# Altium schematic sheet [12] - UARTS.SchDoc
size A3; DocumentNumber: 12; SheetNumber: 12; SheetTotal: 18
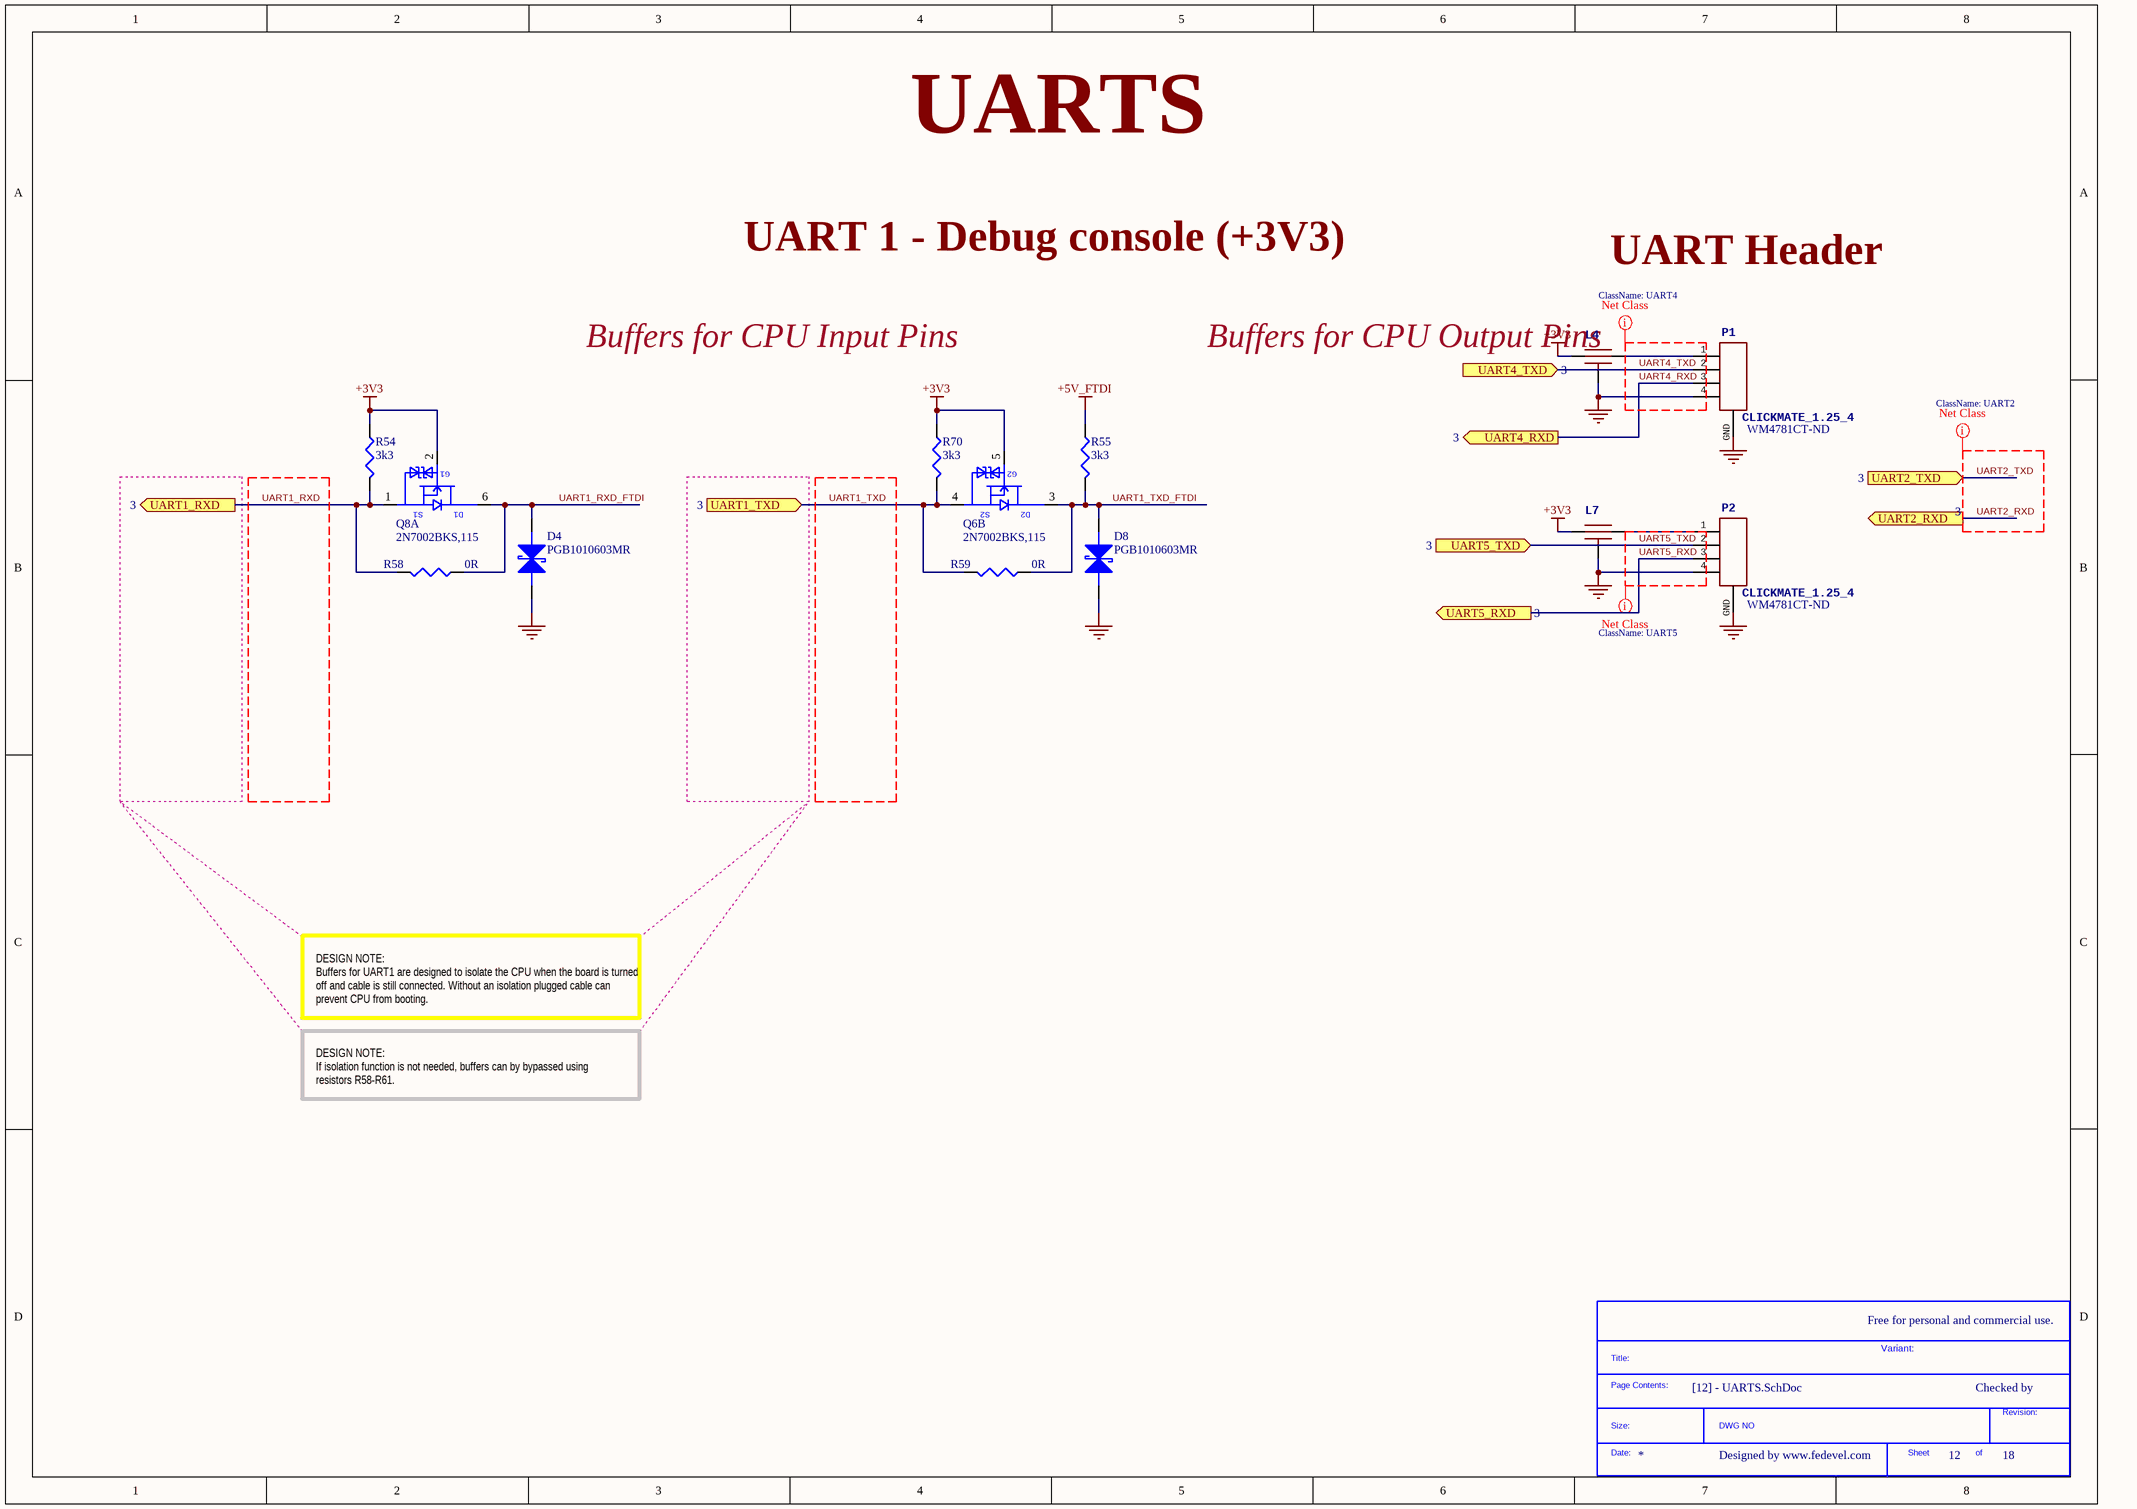
[diagram p0: [12] - UARTS.SchDoc]

## Parts
*  SDTitleBlock  (value not drawn)  (graphical)
D4  PGB1010603MR  [C0603]
D8  PGB1010603MR  [C0603]
L4  Kyocera KNH16C104DA5TS EMI filter  [KYOCERA-KNH16-DA]  (value not drawn)
L7  Kyocera KNH16C104DA5TS EMI filter  [KYOCERA-KNH16-DA]  (value not drawn)
P1  CLICKMATE_1.25_4  Supplier Part Number 1: WM4781CT-ND  [CLICKMATE_V4]
P2  CLICKMATE_1.25_4  Supplier Part Number 1: WM4781CT-ND  [CLICKMATE_V4]
Q6  2N7002BKS,115  [SOT363]  (part B of 2)
Q8  2N7002BKS,115  [SOT363]  (part A of 2)
R54  3k3  [R0402]
R55  3k3  [R0402]
R58  0R  [R0402]
R59  0R  [R0402]
R70  3k3  [R0402]

## Ports
UART1_RXD (out, see 3), UART1_TXD (in, see 3), UART2_RXD (out, see 3), UART2_TXD (in, see 3), UART4_RXD (out, see 3), UART4_TXD (in, see 3), UART5_RXD (out, see 3), UART5_TXD (in, see 3)

## Nets
+3V3: L4.P$1 L7.P$1 Q6.5(GATE2) Q8.2(GATE1) R54.2 R70.2
+5V_FTDI: R55.2
GND: D4.2 D8.2 L4.GND L7.GND P1.4 P1.GND P2.4 P2.GND
UART1_RXD: Q8.1(SOURCE1) R54.1 R58.1 ; port UART1_RXD
UART1_RXD_FTDI: D4.1 Q8.6(DRAIN1) R58.2
UART1_TXD: Q6.4(SOURCE2) R59.1 R70.1 ; port UART1_TXD
UART1_TXD_FTDI: D8.1 Q6.3(DRAIN2) R55.1 R59.2
UART2_RXD: port UART2_RXD
UART2_TXD: port UART2_TXD
UART4_RXD: P1.3 ; port UART4_RXD
UART4_TXD: P1.2 ; port UART4_TXD
UART5_RXD: P2.3 ; port UART5_RXD
UART5_TXD: P2.2 ; port UART5_TXD
NetL4_P$2: L4.P$2 P1.1
NetL7_P$2: L7.P$2 P2.1

## Layout directives
net class UART2: UART2_RXD, UART2_TXD
net class UART4: UART4_RXD, UART4_TXD
net class UART5: UART5_RXD, UART5_TXD

## Notes on the sheet
- UARTS
- UART 1 - Debug console (+3V3)
- UART Header
- Buffers for CPU Input Pins
- Buffers for CPU Output Pins
- DESIGN NOTE:
  Buffers for UART1 are designed to isolate the CPU when the board is turned off and cable is still connected. Without an isolation plugged cable can prevent CPU from booting.
- DESIGN NOTE:
  If isolation function is not needed, buffers can by bypassed using resistors R58-R61.
- Free for personal and commercial use.
- Variant:
- Checked by
- Designed by www.fedevel.com
- (in symbol 2N7002BKS,115, part A) G1; S1; D1
- (in symbol 2N7002BKS,115, part B) G2; S2; D2
- (in symbol SDTitleBlock) Title:; Page Contents:; Revision:; Size:; DWG NO; Date:; Sheet; of

## Library data of the parts
D4 D8 = PGB1010603MR: SUPPRESSOR ESD 24VDC 0603 SMD; Manufacturer: Littelfuse Inc; Voltage - Reverse Standoff (Typ): 24V; Polarization: Bidirectional; .Creator: MM; .Checked PCB: used; Supplier 1: Digi-Key; Manufacturer Part Number: PGB1010603MR; RoHS: RoHS Compliant; Category: Circuit Protection; Stock 1: 155406; Pricing 1: 1=0.66, 10=0.556, 25=0.4872, 100=0.4172, 250=0.3618, 500=0.30646 (USD); Packaging: Cut Tape (CT); Voltage - Breakdown: -; Power (Watts): -; Mounting Type: Surface Mount; Package / Case: 0603 (1608 Metric); Supplier Device Package: 0603 (1608 Metric); ComponentLink1URL: http://www.littelfuse.com/data/en/Data_Sheets/Littelfuse_PulseGuard-ESD_PGB1.pdf; ComponentLink1Description: http://www.littelfuse.com/data/en/Data_Sheets/Littelfuse_PulseGuard-ESD_PGB1.pdf; Supplier Part Number 1: F2594CT-ND; .Checked SCH: used
L4 L7 = KNH16C104DA5TS: Capacitor, Filter, 0.1uF, 25V, 2A, 0603, SMD; 3DR_PARTNO: ECM0719; Supplier 1: Digi-Key; Supplier Part Number 1: 478-6878-1-ND
P1 P2 = CLICKMATE_1.25_4: Connector, Rcpt, 4Pos, 1.25MM, W/B, VERT, SMD, Tin; 3DR_PARTNO: PRT0441; Supplier 1: Digi-Key
Q6 Q8 = 2N7002BKS,115: MOSFET 2N-CH 60V 0.3A 6TSSOP; Manufacturer: NXP Semiconductors; FET Type: 2 N-Channel (Dual); FET Feature: Logic Level Gate; Current - Continuous Drain (Id) @ 25°C: 300mA; Rds On (Max) @ Id, Vgs: 1.6 Ohm @ 500mA, 10V; Vgs(th) (Max) @ Id: 2.1V @ 250µA; Gate Charge (Qg) @ Vgs: 0.6nC @ 4.5V; Input Capacitance (Ciss) @ Vds: 50pF @ 10V; Power - Max: 295mW; .Creator: MM; Supplier 1: Digi-Key; Manufacturer Part Number: 2N7002BKS,115; RoHS: RoHS Compliant; Category: Discrete Semiconductor Products; Stock 1: 34098; Pricing 1: 1=0.54, 10=0.389, 25=0.3028, 100=0.2293, 250=0.16212, 500=0.12978, 1000=0.09954 (USD); Packaging: Cut Tape (CT); Drain to Source Voltage (Vdss): 60V; Mounting Type: Surface Mount; Package / Case: 6-TSSOP, SC-88, SOT-363; Supplier Device Package: 6-TSSOP; ComponentLink1URL: http://www.nxp.com/documents/data_sheet/2N7002BKS.pdf; ComponentLink1Description: http://www.nxp.com/documents/data_sheet/2N7002BKS.pdf; Supplier Part Number 1: 568-5977-1-ND; .Checked SCH: MM; .Checked PCB: MM; Referenced footrpint used by MM: http://www.diodes.com/_files/datasheets/ap02001.pdf
R54 R55 R70 = RC0402FR-073K3L: RES 3.30K OHM 1/16W 1% 0402 SMD; Manufacturer: Yageo; Resistance (Ohms): 3.3K; Power (Watts): 0.063W, 1/16W; .Checked PCB: used; Temperature Coefficient: ±100ppm/°C; Category: Resistors; Supplier Part Number: 311-3.30KLRCT-ND; Manufacturer Part Number: RC0402FR-073K3L; Package / Case: 0402 (1005 Metric); Price 1k [$]: 0.01421; Tolerance: ±1%; Value: 3k3; .Checked SCH: used; Supplier: Digikey; Supplier 1: Digi-Key; Supplier Part Number 1: 311-3.30KLRCT-ND; RoHS: RoHS Compliant; Stock 1: 356340; Pricing 1: 10=0.014, 50=0.0104, 100=0.0079, 250=0.00584, 500=0.00432, 1000=0.00288 (USD); Composition: Thick Film; Features: -; Size / Dimension: 0.039" L x 0.020" W (1.00mm x 0.50mm); Height: 0.016" (0.40mm); Number of Terminations: 2; Packaging: Cut Tape (CT); ComponentLink1URL: http://www.yageo.com/documents/recent/PYu-RC0402_51_RoHS_L_6.pdf; ComponentLink1Description: http://www.yageo.com/documents/recent/PYu-RC0402_51_RoHS_L_6.pdf
R58 R59 = RC0402JR-070RL: RES 0.0 OHM 1/16W 0402 SMD; Manufacturer: Yageo; Resistance (Ohms): 0.0; Power (Watts): 0.063W, 1/16W; Tolerance: Jumper; .Checked PCB: used; Category: Resistors; Supplier Part Number: 311-0.0JRCT-ND; Manufacturer Part Number: RC0402JR-070RL; Package / Case: 0402 (1005 Metric); Price 1k [$]: 0.01389; Value: 0R; .Checked SCH: used; Supplier: Digikey; Supplier 1: Digi-Key; Supplier Part Number 1: 311-0.0JRCT-ND; RoHS: RoHS Compliant; Stock 1: 1106330; Pricing 1: 10=0.012, 50=0.009, 100=0.0069, 250=0.00512, 500=0.0038, 1000=0.00253 (USD); Composition: Thick Film; Features: -; Temperature Coefficient: -; Size / Dimension: 0.039" L x 0.020" W (1.00mm x 0.50mm); Height: 0.016" (0.40mm); Number of Terminations: 2; Packaging: Cut Tape (CT); ComponentLink1URL: http://www.yageo.com/documents/recent/PYu-RC0402_51_RoHS_L_6.pdf; ComponentLink1Description: http://www.yageo.com/documents/recent/PYu-RC0402_51_RoHS_L_6.pdf